# Altium schematic sheet Power_Decoupling.SchDoc: Power and Decoupling
size A4; Author: SORABH GANDHI; DrawnBy: SORABH GANDHI; Engineer: SORABH GANDHI; Organization: University of Colorado Boulder; Revision: 1; SheetNumber: 4; SheetTotal: 10; ProjectName: Low Power Project
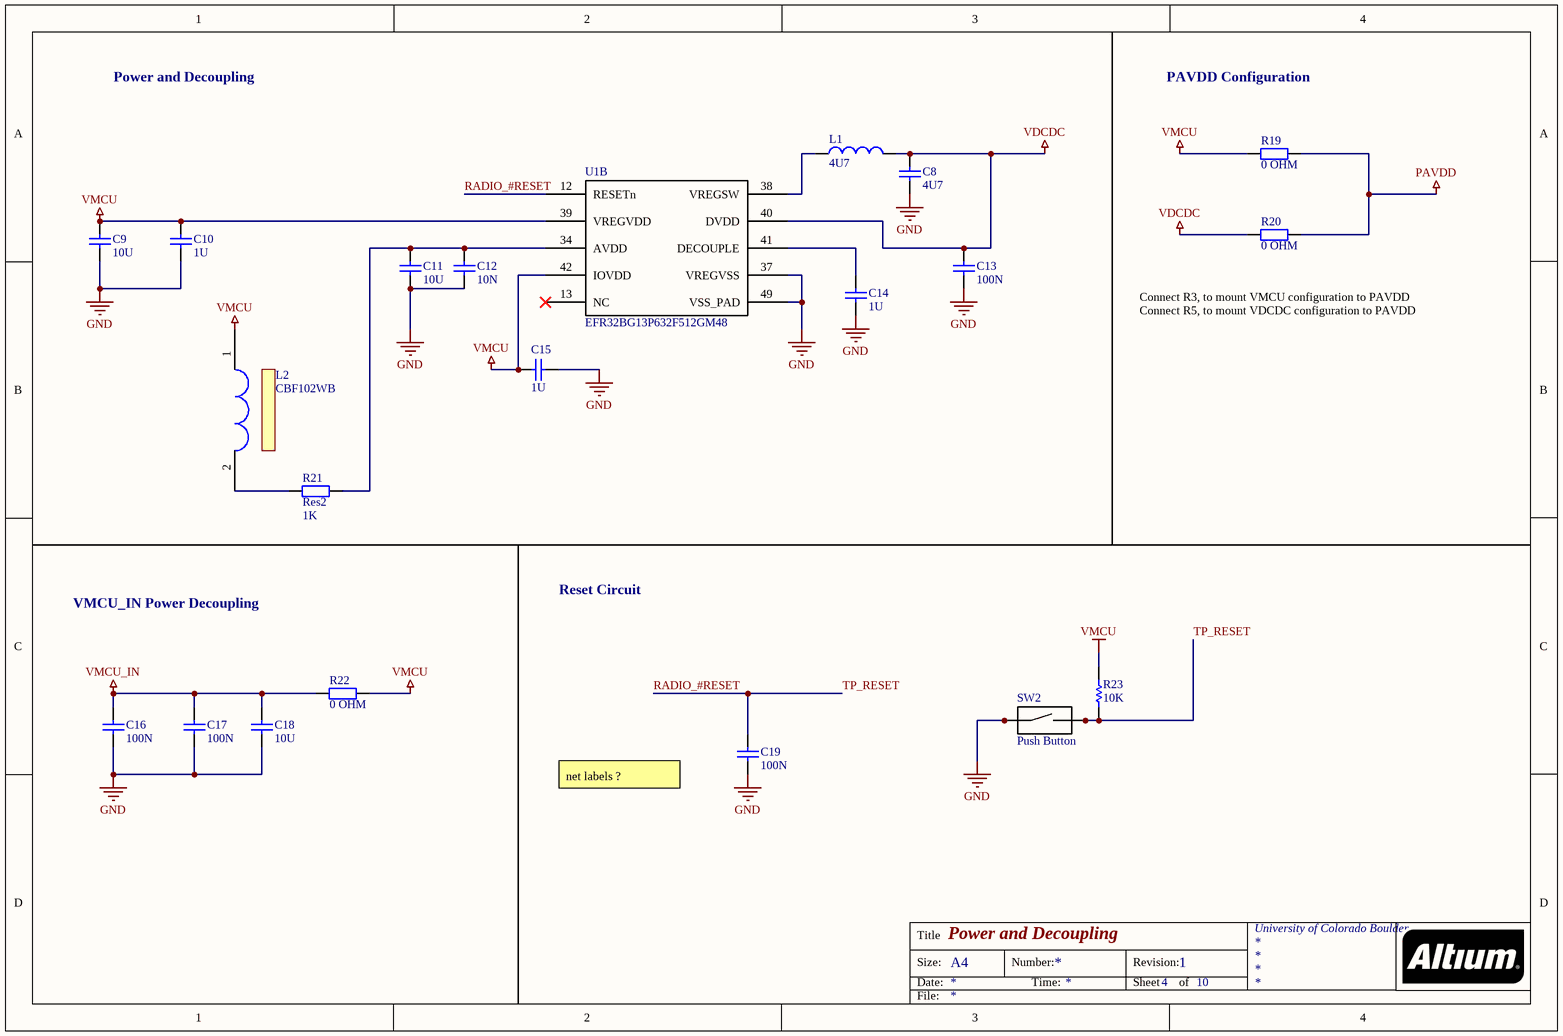
[diagram p0: Power_Decoupling.SchDoc]

## Parts
C8  4U7  [1608[0603]]
C9  10U  [1608[0603]]
C10  1U  [RAD-0.3]
C11  10U  [1608[0603]]
C12  10N  [1608[0603]]
C13  100N  [1608[0603]]
C14  1U  [1608[0603]]
C15  1U  [1608[0603]]
C16  100N  [1608[0603]]
C17  100N  [1608[0603]]
C18  10U  [1608[0603]]
C19  100N  [1608[0603]]
L1  4U7  [0402-A]
L2  CBF102WB  [*CAPC0603X56N]
R19  0 OHM  [AXIAL-0.4]
R20  0 OHM  [AXIAL-0.4]
R21  Res2  value 1K  [AXIAL-0.4]
R22  0 OHM  [1608[0603]]
R23  value 10K  [1608[0603]]  (hidden comment: Res1)
SW2  Push Button  [Push Button]
U1  EFR32BG13P632F512GM48  [*QFN50P700X700X90-49N]  (part B of 3)

## Nets
GND: C8.1 C9.1 C10.1 C11.1 C12.1 C13.1 C14.1 C15.1 C16.1 C17.1 C18.1 C19.1 SW2.3 SW2.4 U1.37(VREGVSS) U1.49(VSS_PAD)
PAVDD: R19.2 R20.2
VDCDC: C8.2 C13.2 L1.2 R20.1 U1.40(DVDD)
VMCU: C9.2 C10.2 C15.2 L2.1 R19.1 R22.2 R23.2 U1.39(VREGVDD) U1.42(IOVDD)
VMCU_IN: C16.2 C17.2 C18.2 R22.1
RADIO_#RESET: C19.2 R23.1 SW2.1 SW2.2 U1.12(RESETn)  [also labelled TP_RESET]
NetC11_2: C11.2 C12.2 R21.2 U1.34(AVDD)
NetC14_2: C14.2 U1.41(DECOUPLE)
NetL1_1: L1.1 U1.38(VREGSW)
NetL2_2: L2.2 R21.1

Not connected (* = marked no-connect by the designer): U1 13(NC)*

## Notes on the sheet
- Power and Decoupling
- PAVDD Configuration
- Connect R3, to mount VMCU configuration to PAVDD
  Connect R5, to mount VDCDC configuration to PAVDD
- VMCU_IN Power Decoupling
- Reset Circuit
- net labels ?
- Title
- Size:
- Date:
- A4
- Number:
- Time:
- Revision:
- Sheet
- of
- File:

## Library data of the parts
C8 = Cap: CAP CER 4.7UF 25V X5R 0603; Manufacturer: Samsung Electro-Mechanics; Manufacturer Part Number: CL10A475KA8NQNC; Value: 4U7; Digi-Key Part Number: 1276-1900-1-ND; DigiKeyURL: https://www.digikey.com/product-detail/en/samsung-electro-mechanics/CL10A475KA8NQNC/1276-1900-1-ND/3889986
C9 C11 = Cap: CAP CER 10UF 6.3V X5R 0603; Manufacturer: Samsung Electro-Mechanics; Manufacturer Part Number: CL10A106MQ8NNNC; Value: 10U; Digi-Key Part Number: 1276-1119-1-ND; DigiKeyURL: https://www.digikey.com/product-detail/en/samsung-electro-mechanics/CL10A106MQ8NNNC/1276-1119-1-ND/3889205
C10 C14 C15 = Cap: CAP CER 1UF 25V X5R 0603; Manufacturer: Samsung Electro-Mechanics; Manufacturer Part Number: CL10A105KA8NNNC; Value: 1U; DigiKeyURL: https://www.digikey.com/product-detail/en/samsung-electro-mechanics/CL10A105KA8NNNC/1276-1102-1-ND/3889188; Digi-Key Part Number: 1276-1102-1-ND
C12 = Cap: CAP CER 10000PF 16V X7R 0603; Manufacturer: KEMET; Manufacturer Part Number: C0603C103K4RACTU; Value: 10N; Digi-Key Part Number: 399-7841-1-ND; DigiKeyURL: https://www.digikey.com/product-detail/en/kemet/C0603C103K4RACTU/399-7841-1-ND/3471564
C13 C16 C17 C19 = Cap: CAP CER 0.1UF 16V X7R 0603; Manufacturer: Samsung Electro-Mechanics; Manufacturer Part Number: CL10B104KO8NNNC; Value: 100N; Digi-Key Part Number: 1276-1005-1-ND; DigiKeyURL: https://www.digikey.com/product-detail/en/samsung-electro-mechanics/CL10B104KO8NNNC/1276-1005-1-ND/3889091
C18 = Cap: CAP CER 10UF 6.3V X5R 0603; Manufacturer: Murata Electronics; Manufacturer Part Number: GRM188R60J106KE47D; Value: 10U; DigiKeyURL: https://www.digikey.com/product-detail/en/murata-electronics/GRM188R60J106KE47D/490-12538-1-ND/5797528; Digi-Key Part Number: 490-12538-1-ND
L1 = Inductor: FIXED IND 4.7UH 1.25A 130 MOHM; Manufacturer: Murata Electronics; Manufacturer Part Number: LQH3NPN4R7MM0L; Value: 4U7; Mouser Part Number: 81-LQH3NPN4R7MM0L; MouserURL: https://www.mouser.com/ProductDetail/Murata-Electronics/LQH3NPN4R7MM0L?qs=MY6wChARw2xsFxTl%252BVh9Ew%3D%3D
L2 = COMPONENT_1: FERRITE BEAD 1 KOHM 0603 1LN; Manufacturer: Wurth Electronics Inc.; Manufacturer Part Number: 74279266; Digi-Key Part Number: 732-4484-1-ND; DigiKeyURL: https://www.digikey.com/product-detail/en/wurth-electronics-inc/74279266/732-4484-1-ND/3907313; Value: CBF102WB
R19 R20 R22 = Res2: RES SMD 0 OHM JUMPER 1/10W 0603; Manufacturer: Yageo; Manufacturer Part Number: RC0603JR-070RL; Value: 0 OHM; Digi-Key Part Number: 311-0.0GRCT-ND; DigiKeyURL: https://www.digikey.com/product-detail/en/yageo/RC0603JR-070RL/311-0.0GRCT-ND/729622
R21 = Res2: Resistor; Published: 8-Jun-2000; LatestRevisionDate: 17-Jul-2002; LatestRevisionNote: Re-released for DXP Platform.; PackageReference: AXIAL-0.4; Publisher: Altium Limited; PackageDescription: Axial Device, Thru-Hole; 2 Leads; 0.4 in Pin Spacing
R23 = Res1: RES 10K OHM 1% 1/8W 0603; Manufacturer: Stackpole Electronics Inc; Manufacturer Part Number: RNCP0603FTD10K0; Digi-Key Part Number: RNCP0603FTD10K0CT-ND; DigiKeyURL: https://www.digikey.com/product-detail/en/stackpole-electronics-inc/RNCP0603FTD10K0/RNCP0603FTD10K0CT-ND/2240478
SW2 = Push Button: SWITCH TACTILE SPST-NO 0.05A 24V; Manufacturer: TE Connectivity ALCOSWITCH Switches; Manufacturer Part Number: FSM6JSMATR; Digi-Key Part Number: 450-2058-1-ND; DigiKeyURL: https://www.digikey.com/products/en?keywords=450-2058-1-ND
U1 = EFR32BG13: MCU; Manufacturer: Silicon Labs; Manufacturer Part Number: EFR32BG13P632F512GM48-BR; CompDescription: Data Sheet; Value: EFR32BG13P632F512GM48; CompURL: https://www.silabs.com/documents/public/data-sheets/efr32bg13-datasheet.pdf; Mouser Part Number: 634-EFR32BG13P632-BR; MouserURL: https://www.mouser.com/ProductDetail/Silicon-Labs/EFR32BG13P632F512GM48-BR?qs=5aG0NVq1C4xCQ7DNn6l3Yw%3D%3D